# EAGLE design HuXtension_rev_A_layer1 (EAGLE 9.6.2)
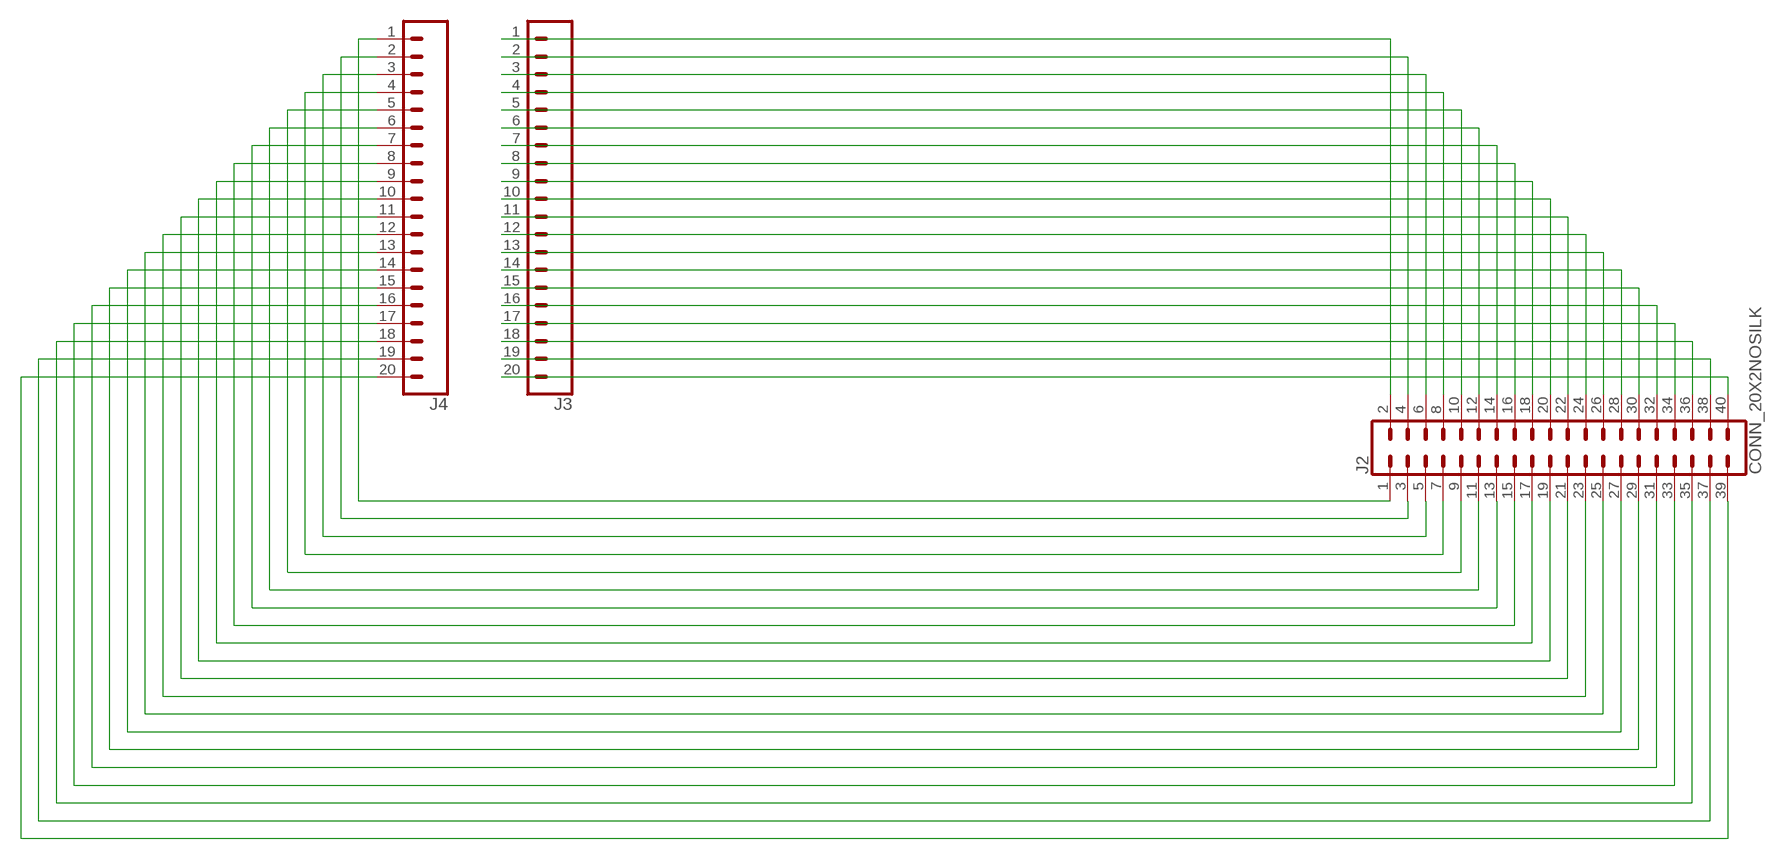
[diagram p0: schematic, sheet 1]

## Parts
J2  CONN_20X2NOSILK  [2X20_NOSILK]
J3  CONN_20NOSILK  [1X20_NOSILK]
J4  CONN_20NOSILK  [1X20_NOSILK]

## Nets
N$1: J2.1 J4.1
N$3: J2.3 J4.2
N$5: J2.5 J4.3
N$7: J2.7 J4.4
N$9: J2.9 J4.5
N$11: J2.11 J4.6
N$16: J2.15 J4.8
N$18: J2.17 J4.9
N$19: J2.19 J4.10
N$21: J2.21 J4.11
N$23: J2.23 J4.12
N$25: J2.25 J4.13
N$27: J2.27 J4.14
N$28: J2.2 J3.1
N$29: J2.29 J4.15
N$30: J2.4 J3.2
N$31: J2.31 J4.16
N$32: J2.6 J3.3
N$33: J2.33 J4.17
N$34: J2.8 J3.4
N$35: J2.35 J4.18
N$36: J2.10 J3.5
N$37: J2.37 J4.19
N$38: J2.39 J4.20
N$39: J2.40 J3.20
N$40: J2.13 J4.7
N$41: J2.38 J3.19
N$42: J2.36 J3.18
N$43: J2.34 J3.17
N$44: J2.32 J3.16
N$45: J2.12 J3.6
N$46: J2.14 J3.7
N$47: J2.16 J3.8
N$48: J2.18 J3.9
N$53: J2.20 J3.10
N$54: J2.22 J3.11
N$55: J2.24 J3.12
N$57: J2.26 J3.13
N$58: J2.28 J3.14
N$59: J2.30 J3.15

## Library data of the parts
J2 = SparkFun-Connectors:CONN_20X2: Multi connection point. Often used as Generic Header-pin footprint for 0.1 inch spaced/style header connections On any of the 0.1 inch spaced packages, you can populate with these: Break Away Headers - Straight <https://www.sparkfun.com/products/116> (PRT-00116) Break Away Male Headers - Right Angle <https://www.sparkfun.com/products/553> (PRT-00553) Female Headers <https://www.sparkfun.com/products/115> (PRT-00115) Break Away Headers - Machine Pin <https://www.sparkfun.com/products/117> (PRT-00117) Break Away Female Headers - Swiss Machine Pin <https://www.sparkfun.com/products/743> (PRT-00743)
J3 J4 = SparkFun-Connectors:CONN_20: Multi connection point. Often used as Generic Header-pin footprint for 0.1 inch spaced/style header connections On any of the 0.1 inch spaced packages, you can populate with these: Break Away Headers - Straight <https://www.sparkfun.com/products/116> (PRT-00116) Break Away Male Headers - Right Angle <https://www.sparkfun.com/products/553> (PRT-00553) Female Headers <https://www.sparkfun.com/products/115> (PRT-00115) Break Away Headers - Machine Pin <https://www.sparkfun.com/products/117> (PRT-00117) Break Away Female Headers - Swiss Machine Pin <https://www.sparkfun.com/products/743> (PRT-00743) For SCREWTERMINALS and SPRING TERMINALS visit here: Screw Terimnals on SparkFun.com <https://www.sparkfun.com/search/results?term=Screw+Terminals> (5mm/3.5mm/2.54mm spacing) This device is also useful as a general connection point to wire up your design to another part of your project. Our various solder wires solder well into these plated through hole pads. Hook-Up Wire - Assortment (Stranded, 22 AWG) <https://www.sparkfun.com/products/11375> (PRT-11375) Hook-Up Wire - Assortment (Solid Core, 22 AWG) <https://www.sparkfun.com/products/11367> (PRT-11367) View the entire wire category on our website here <https://www.sparkfun.com/categories/141> Special notes: Molex polarized connector foot print use with SKU : PRT-08231 with associated crimp pins and housings. 1MM SMD Version SKU: PRT-10208 NOTES ON THE VARIANTS LOCK and LOCK_LONGPADS... This footprint was designed to help hold the alignment of a through-hole component (i.e. 6-pin header) while soldering it into place. You may notice that each hole has been shifted either up or down by 0.005 of an inch from it's more standard position (which is a perfectly straight line). This slight alteration caused the pins (the squares in the middle) to touch the edges of the holes. Because they are alternating, it causes a "brace" to hold the component in place. 0.005 has proven to be the perfect amount of "off-center" position when using our standard breakaway headers. Although looks a little odd when you look at the bare footprint, once you have a header in there, the alteration is very hard to notice. Also,if you push a header all the way into place, it is covered up entirely on the bottom side. Note about LOCK SPECIAL package: This is just like the LOCK variant in that the holes are staggared by 5 mil, but except for the last two holes. They are not altered from the "standard" footprint layout. This is used for a special purpose on the layout of our Graphic LCD Backpack. Make sure you want to use this device before selecting it for you project!

## Board
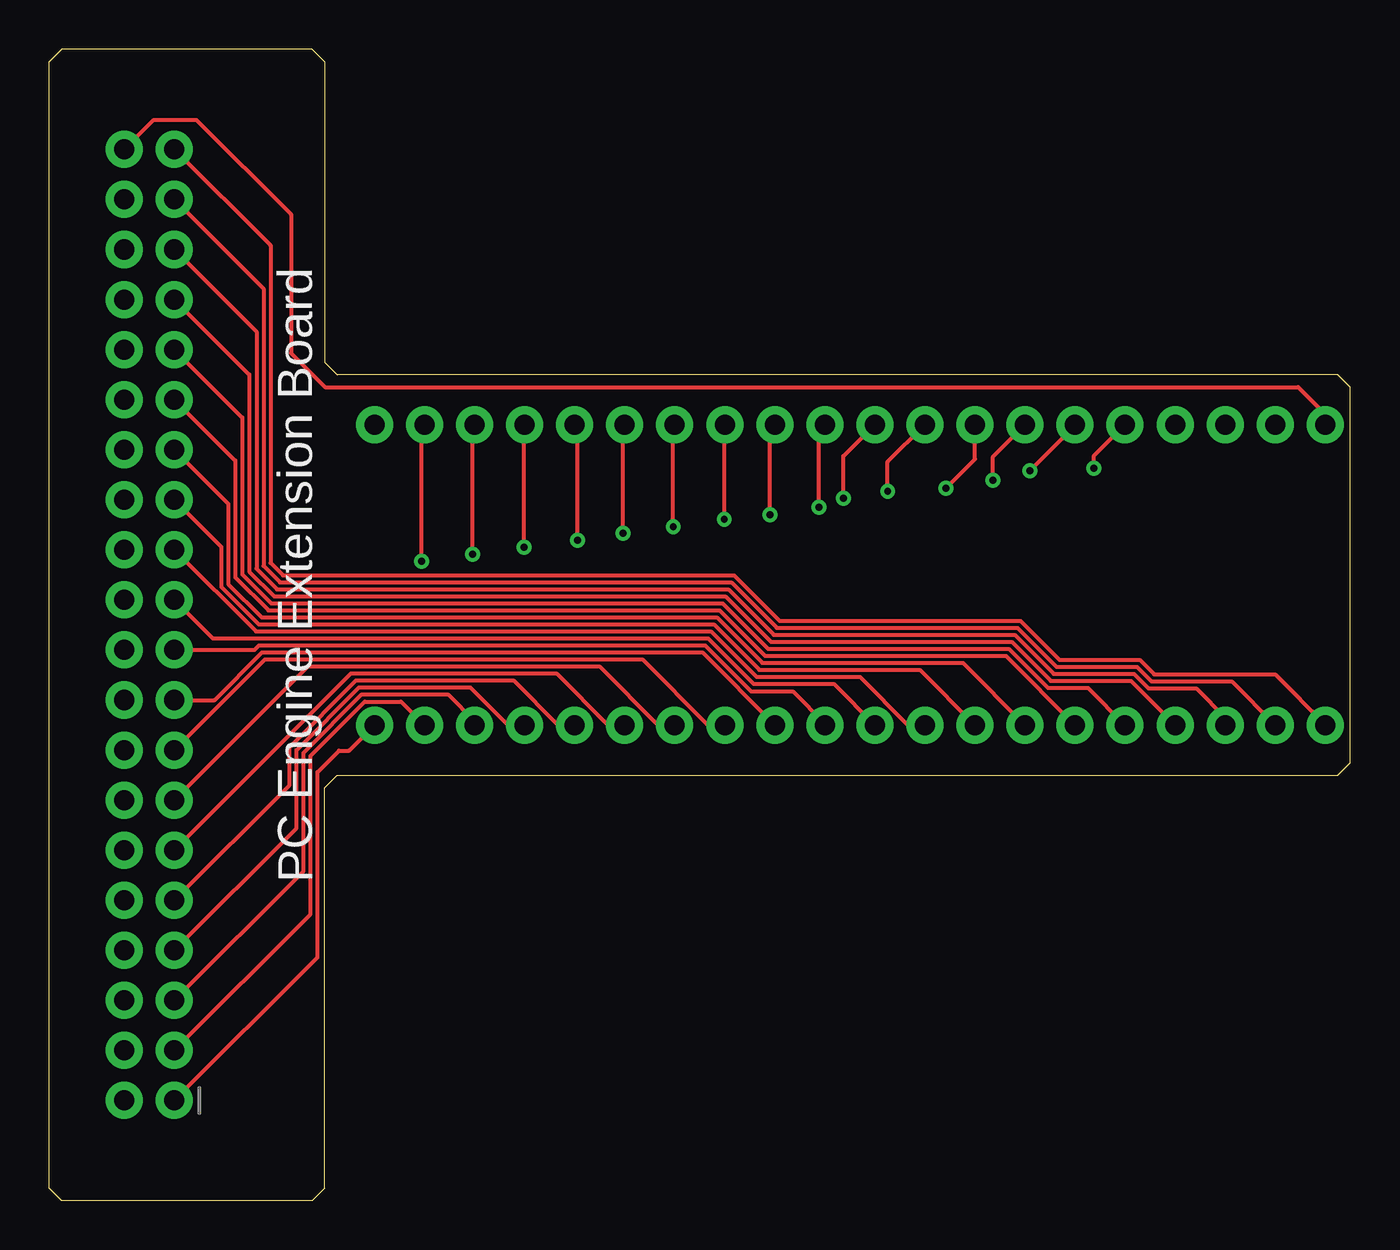
[diagram p1: board, top side]
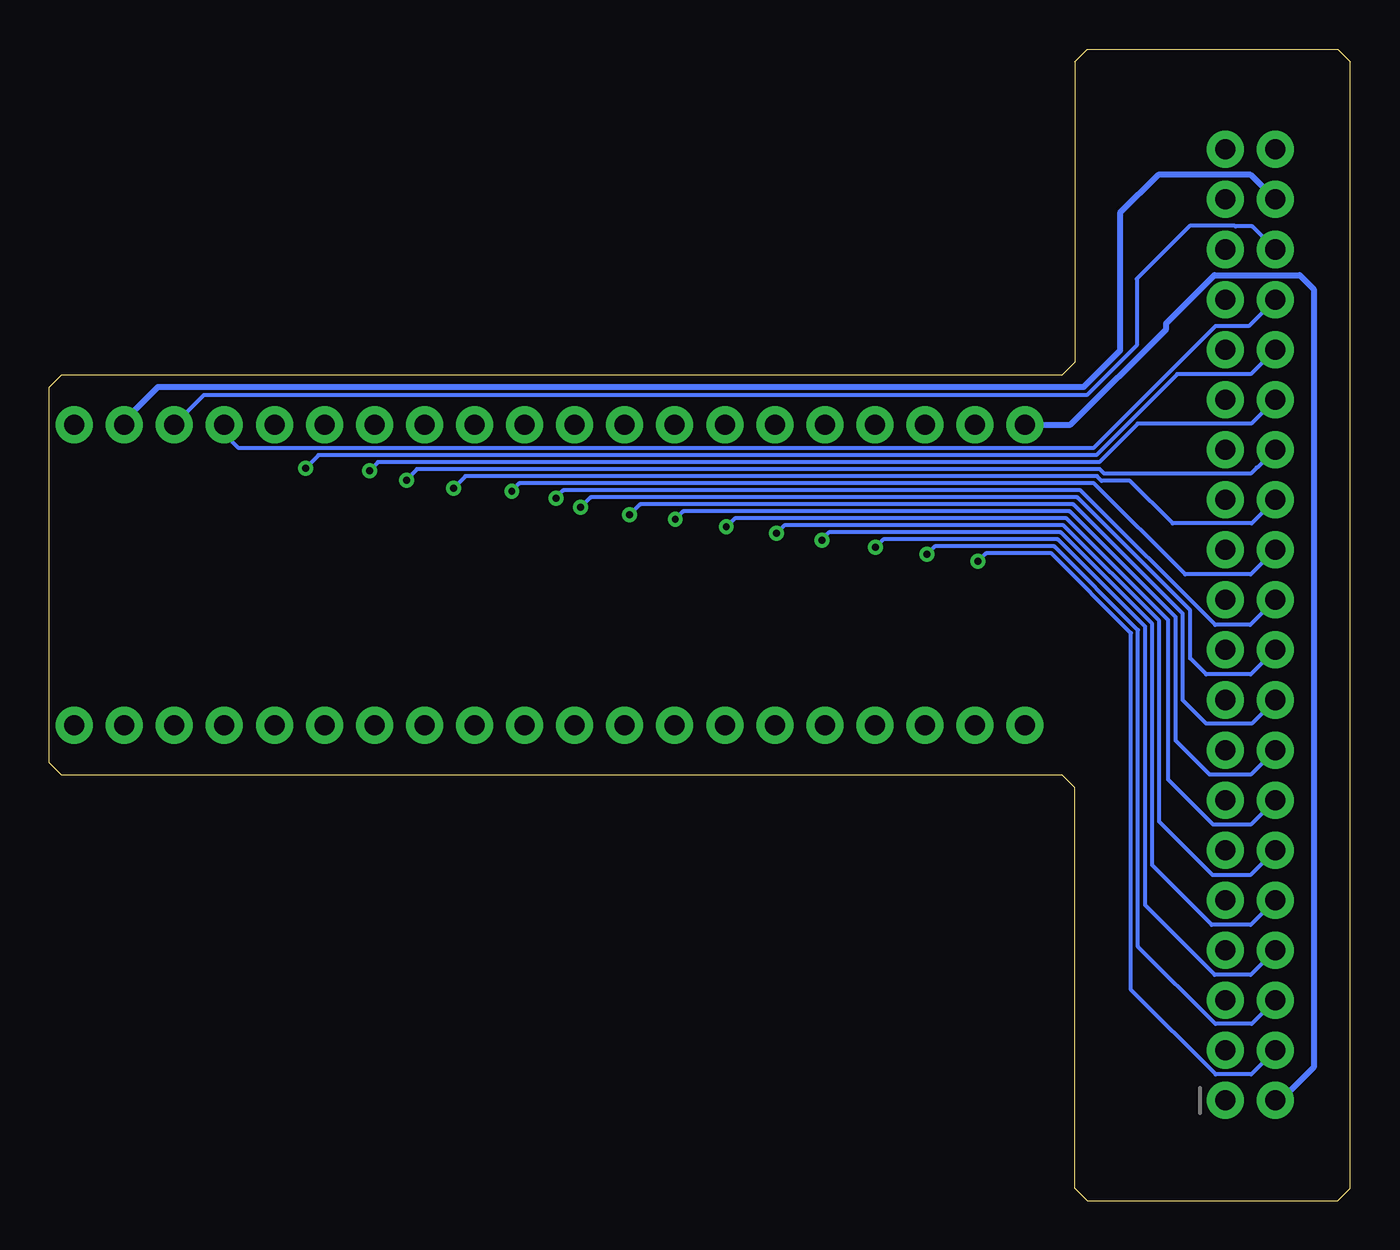
[diagram p2: board, bottom side, seen from below]

Size 66.04 x 58.42 mm. Coordinates in mm from the lower left corner, seen from the top.
Outline: 13.97,57.78 13.97,42.55 14.61,41.91 65.41,41.91 66.04,41.27 66.04,22.23 65.41,21.59 14.61,21.59 13.97,20.95 13.97,0.64 13.34,0 0.64,0 0,0.64 0,57.78 0.64,58.42 13.34,58.42 13.97,57.78
Copper layers (1*16): Top 0.035mm / dielectric 1.5mm / Bottom 0.035mm
Design rules "default *": minimum track width 6mil, minimum drill 0.35mm, track to track 6mil, track to pad 6mil, pad to pad 6mil, via to via 6mil, smd to smd 6mil, copper to edge 10mil, drill to drill 6mil, minimum pad ring 10mil, minimum via ring 8mil, stop-mask expansion 2mil, vias tented up to drill 15mil, thermal gap 10mil

### Footprints (pad centres in the part's own frame; a part is rotated, then mirrored left to right if it is on the bottom)
2X20_NOSILK = drill 1.016 pad 1.88: 1 0,0; 2 0,2.54; 3 2.54,0; 4 2.54,2.54; 5 5.08,0; 6 5.08,2.54; 7 7.62,0; 8 7.62,2.54; 9 10.16,0; 10 10.16,2.54; 11 12.7,0; 12 12.7,2.54; 13 15.24,0; 14 15.24,2.54; 15 17.78,0; 16 17.78,2.54; 17 20.32,0; 18 20.32,2.54; 19 22.86,0; 20 22.86,2.54; 21 25.4,0; 22 25.4,2.54; 23 27.94,0; 24 27.94,2.54; 25 30.48,0; 26 30.48,2.54; 27 33.02,0; 28 33.02,2.54; 29 35.56,0; 30 35.56,2.54; 31 38.1,0; 32 38.1,2.54; 33 40.64,0; 34 40.64,2.54; 35 43.18,0; 36 43.18,2.54; 37 45.72,0; 38 45.72,2.54; 39 48.26,0; 40 48.26,2.54
1X20_NOSILK = drill 1.016 pad 1.88: 1 0,0; 2 2.54,0; 3 5.08,0; 4 7.62,0; 5 10.16,0; 6 12.7,0; 7 15.24,0; 8 17.78,0; 9 20.32,0; 10 22.86,0; 11 25.4,0; 12 27.94,0; 13 30.48,0; 14 33.02,0; 15 35.56,0; 16 38.1,0; 17 40.64,0; 18 43.18,0; 19 45.72,0; 20 48.26,0

### Placement (x,y rotation side)
J2  6.35,5.08 90 top
J3  16.51,39.37 0 top
J4  16.51,24.13 0 top

### Tracks (layer width: path | path; a pad name or v marks a point on that pad's centre or on a via)
N$1
  Top 0.203: J2.1 13.61,12.34 13.61,21.74 14.71,22.83 15.21,22.83 J4.1
N$3
  Top 0.203: J2.3 13.26,14.53 13.26,22.57 16.02,25.32 17.86,25.32 J4.2
N$5
  Top 0.203: J2.5 12.9,16.71 12.9,22.71 15.87,25.68 20.24,25.68 21.59,24.33 J4.3
N$7
  Top 0.203: J2.7 12.55,18.9 12.55,22.86 15.72,26.04 21.37,26.04 23.28,24.13 J4.4
N$9
  Top 0.203: J2.9 12.19,21.08 12.19,23.01 15.57,26.39 23.56,26.39 25.82,24.13 J4.5
N$11
  Top 0.203: J4.6 28.36,24.13 25.74,26.75 15.32,26.75 J2.11
N$16
  Top 0.203: J4.8 33.44,24.13 30.11,27.46 10.95,27.46 J2.15
N$18
  Top 0.203: J2.17 8.39,25.4 10.8,27.81 33.15,27.81 J4.9
N$19
  Top 0.203: J2.19 10.42,27.94 10.65,28.17 33.29,28.17 35.63,25.83 37.74,25.83 39.37,24.21 J4.10
N$21
  Top 0.203: J2.21 8.31,28.52 33.44,28.52 35.75,26.21 39.83,26.21 J4.11
N$23
  Top 0.203: J2.23 10.49,28.88 33.59,28.88 35.9,26.57 41.16,26.57 43.6,24.13 J4.12
N$25
  Top 0.203: J2.25 8.74,33.17 8.74,31.14 10.64,29.23 33.74,29.23 36.05,26.92 44.2,26.92 J4.13
N$27
  Top 0.203: J2.27 9.09,35.36 9.09,31.28 10.79,29.59 33.88,29.59 36.2,27.28 46.38,27.28 J4.14
N$28
  Bottom 0.305: J3.1 14.2,39.37 9.35,44.22 9.35,44.51 6.89,46.97 2.56,46.97 1.85,46.25 1.85,6.76 3.53,5.08 J2.2
N$29
  Top 0.203: J2.29 9.45,37.54 9.45,31.62 11.12,29.95 34.03,29.95 36.34,27.64 48.56,27.64 J4.15
N$30  (via drill 0.35)
  Top 0.203: v18.9,32.44 18.9,39.22 J3.2
  Bottom 0.203: J2.4 5.03,6.4 6.83,6.4 11.12,10.69 11.12,28.8 15.17,32.84 18.49,32.84 v18.9,32.44
N$31
  Top 0.203: J2.31 9.8,39.73 9.8,31.77 11.27,30.3 34.18,30.3 36.49,27.99 48.71,27.99 50.69,26.01 52.73,26.01 J4.16
N$32  (via drill 0.35)
  Top 0.203: v21.49,32.79 21.49,39.27 J3.3
  Bottom 0.203: J2.6 5,8.97 6.84,8.97 10.77,12.89 10.77,28.95 15.02,33.2 21.09,33.2 v21.49,32.79
N$33
  Top 0.203: J2.33 10.16,41.91 10.16,31.92 11.42,30.66 34.33,30.66 36.64,28.35 48.86,28.35 50.84,26.36 54.91,26.36 J4.17
N$34  (via drill 0.35)
  Top 0.203: v24.11,33.15 24.11,39.34 J3.4
  Bottom 0.203: J2.8 5.05,11.46 6.88,11.46 10.41,14.99 10.41,29.12 14.85,33.55 23.7,33.55 v24.11,33.15
N$35
  Top 0.203: J2.35 10.52,44.09 10.52,32.06 11.57,31.01 34.47,31.01 36.78,28.7 49.01,28.7 50.99,26.72 55.06,26.72 55.8,25.98 58.22,25.98 59.69,24.51 J4.18
N$36  (via drill 0.35)
  Top 0.203: v26.82,33.51 26.82,39.22 J3.5
  Bottom 0.203: J2.10 5.05,13.99 7.04,13.99 10.06,17.02 10.06,29.27 14.7,33.91 26.47,33.91 26.82,33.55 v26.82,33.51
N$37
  Top 0.203: J2.37 10.87,46.28 10.87,32.21 11.71,31.37 34.62,31.37 36.93,29.06 49.15,29.06 51.13,27.08 55.21,27.08 55.95,26.34 60.02,26.34 J4.19
N$38
  Top 0.203: J2.39 11.23,48.46 11.23,32.36 11.86,31.73 34.77,31.73 37.08,29.41 49.3,29.41 51.28,27.43 55.36,27.43 56.09,26.7 62.23,26.7 64.77,24.16 J4.20
N$39
  Top 0.203: J2.40 5.31,54.84 7.47,54.84 12.27,50.04 12.27,43 13.99,41.27 63.4,41.27 64.77,39.9 J3.20
N$40
  Top 0.203: J4.7 30.9,24.13 27.93,27.1 13.13,27.1 J2.13
N$41
  Bottom 0.305: J2.38 5.05,52.05 9.75,52.05 11.68,50.11 11.68,43.13 13.54,41.27 60.53,41.27 62.23,39.57 J3.19
N$42
  Bottom 0.203: J3.18 58.19,40.87 13.37,40.87 10.84,43.4 10.84,46.77 8.15,49.45 5.86,49.45 5.83,49.43 4.98,49.43 J2.36
N$43
  Bottom 0.203: J2.34 5.16,44.37 6.84,44.37 13.04,38.18 56.41,38.18 57.15,38.91 J3.17
N$44  (via drill 0.35)
  Top 0.203: v53.03,37.16 53.03,37.8 J3.16
  Bottom 0.203: J2.32 5.05,41.94 8.78,41.94 12.89,37.82 52.38,37.82 v53.03,37.16
N$45  (via drill 0.35)
  Top 0.203: v29.13,33.86 29.13,39.29 J3.6
  Bottom 0.203: J2.12 5.08,16.51 6.99,16.51 9.7,19.23 9.7,29.41 14.55,34.27 28.73,34.27 v29.13,33.86
N$46  (via drill 0.35)
  Top 0.203: v31.67,34.19 31.67,39.29 J3.7
  Bottom 0.203: J2.14 5.05,19.07 6.96,19.07 9.25,21.36 9.25,29.46 14.41,34.62 31.24,34.62 v31.67,34.19
N$47  (via drill 0.35)
  Top 0.203: v34.27,34.57 34.27,39.34 J3.8
  Bottom 0.203: J2.16 5.05,21.61 7.14,21.61 8.87,23.34 8.87,29.61 14.23,34.98 33.86,34.98 v34.27,34.57
N$48  (via drill 0.35)
  Top 0.203: v36.58,34.8 36.58,39.12 J3.9
  Bottom 0.203: J2.18 5,24.21 7.32,24.21 8.51,25.4 8.51,29.78 14.06,35.33 36.04,35.33 v36.58,34.8
N$53  (via drill 0.35)
  Top 0.203: v39.06,35.18 39.06,39.06 J3.10
  Bottom 0.203: J2.20 5.05,26.7 7.32,26.7 8.13,27.51 8.13,29.95 13.86,35.69 38.56,35.69 v39.06,35.18
N$54  (via drill 0.35)
  Top 0.203: v40.31,35.64 40.31,37.77 J3.11
  Bottom 0.203: J2.22 5.08,29.21 6.86,29.21 13.69,36.04 39.95,36.04 40.31,35.69 v40.31,35.64
N$55  (via drill 0.35)
  Top 0.203: v42.56,35.99 42.56,37.48 J3.12
  Bottom 0.203: J2.24 5.05,31.77 8.38,31.77 13.01,36.4 42.19,36.4 42.56,36.03 v42.56,35.99
N$57  (via drill 0.35)
  Top 0.203: v45.52,36.14 46.99,37.62 J3.13
  Bottom 0.203: J2.26 5,34.37 9.02,34.37 11.18,36.52 12.63,36.52 12.86,36.75 44.91,36.75 v45.52,36.14
N$58  (via drill 0.35)
  Top 0.203: v47.9,36.55 47.9,37.74 J3.14
  Bottom 0.203: J2.28 4.72,37.19 4.75,37.19 5.05,36.88 12.48,36.88 12.71,37.11 47.37,37.11 47.9,36.58 v47.9,36.55
N$59  (via drill 0.35)
  Top 0.203: v49.78,37.03 52.07,39.32 J3.15
  Bottom 0.203: J2.30 5.03,39.42 10.79,39.42 12.75,37.47 49.35,37.47 v49.78,37.03

### Text on the board
tNames: PC Engine Extension Board
tValues: Aud_In :2 | A16 :4 | A12 :6 | A6 :8 | A4 :10 | A2 :12 | A0 :14 | D1 :16 | GND :18 | D4 :20 | D6: 22 | A20 :24 | /OE :26 | A9 :28 | A13 :30 | A17 :32 | /WR :34 | /Reset :36 | +5V :38 | NC :40 | 1: Detect | 3: A19 | 5: A15 | 7: A7 | 9: A5 | 11: A3 | 13: A1 | 15: D0 | 17: D2 | 19: D3 | 21: D5 | 23: D7 | 25: A10 | 27: A11 | 29: A8 | 31: A14 | 33: A18 | 35: HiSpd | 37: /IRQ2 | 39: NC